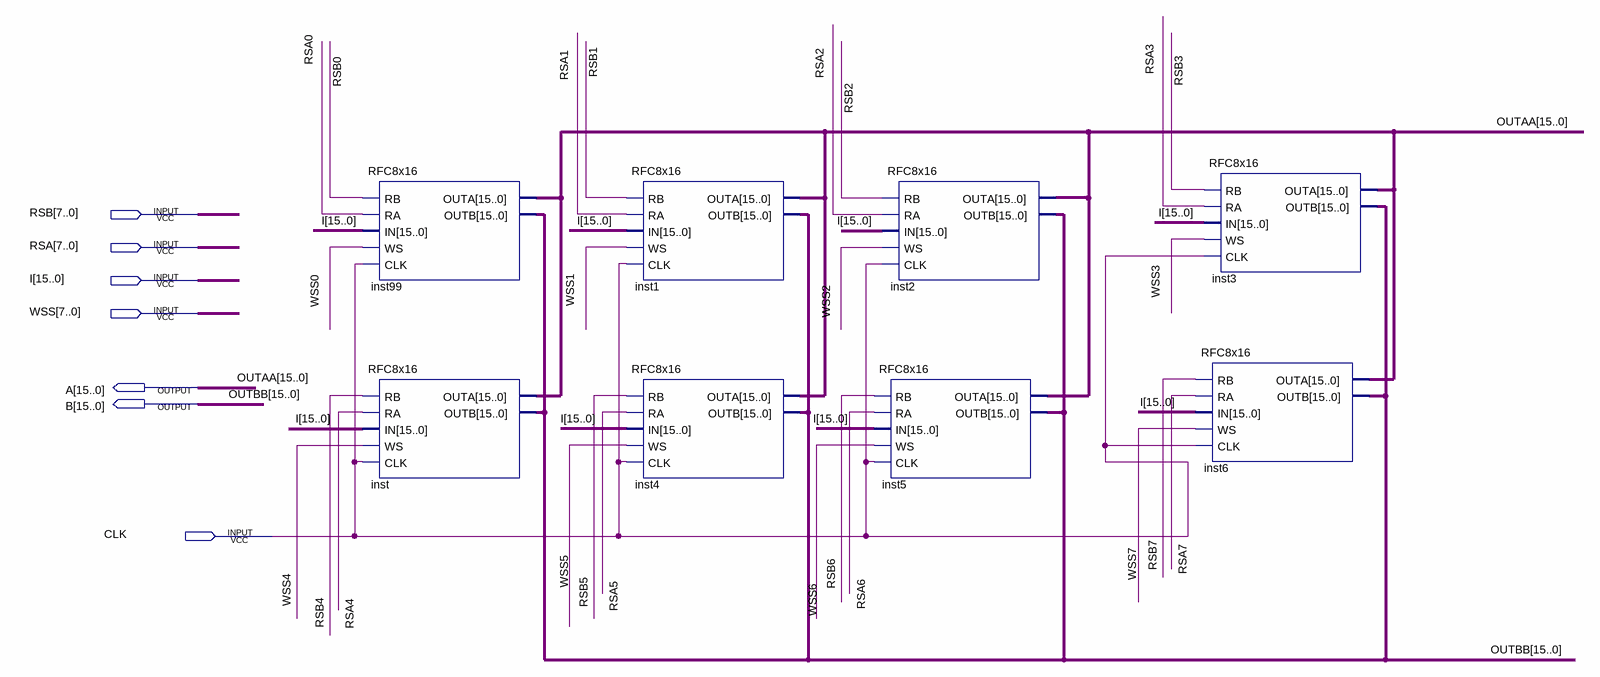
[diagram p0: schematic sheet]
// Quartus schematic RFC8X16REAL.bdf as structural Verilog: 8 symbols, 7 pins
module RFC8X16REAL (
  input  [7:0] RSB,
  input  [7:0] RSA,
  input  [15:0] I,
  input  [7:0] WSS,
  input  CLK,
  output [15:0] A,
  output [15:0] B
);

  RFC8x16 inst99 (.RB(RSB[0]), .RA(RSA[0]), .IN(I), .WS(WSS[0]), .CLK(CLK), .OUTA(A), .OUTB(B));
  RFC8x16 inst (.RB(RSB[4]), .RA(RSA[4]), .IN(I), .WS(WSS[4]), .CLK(CLK), .OUTA(A), .OUTB(B));
  RFC8x16 inst1 (.RB(RSB[1]), .RA(RSA[1]), .IN(I), .WS(WSS[1]), .CLK(CLK), .OUTA(A), .OUTB(B));
  RFC8x16 inst4 (.RB(RSB[5]), .RA(RSA[5]), .IN(I), .WS(WSS[5]), .CLK(CLK), .OUTA(A), .OUTB(B));
  RFC8x16 inst2 (.RB(RSB[2]), .RA(RSA[2]), .IN(I), .WS(WSS[2]), .CLK(CLK), .OUTA(A), .OUTB(B));
  RFC8x16 inst5 (.RB(RSB[6]), .RA(RSA[6]), .IN(I), .WS(WSS[6]), .CLK(CLK), .OUTA(A), .OUTB(B));
  RFC8x16 inst3 (.RB(RSB[3]), .RA(RSA[3]), .IN(I), .WS(WSS[3]), .CLK(CLK), .OUTA(A), .OUTB(B));
  RFC8x16 inst6 (.RB(RSB[7]), .RA(RSA[7]), .IN(I), .WS(WSS[7]), .CLK(CLK), .OUTA(A), .OUTB(B));

  // Other names for the same wires on the sheet: OUTAA[15:0] = A; OUTBB[15:0] = B
endmodule
